# Altium schematic sheet TMS320F28379D_PWM.SchDoc
size A4
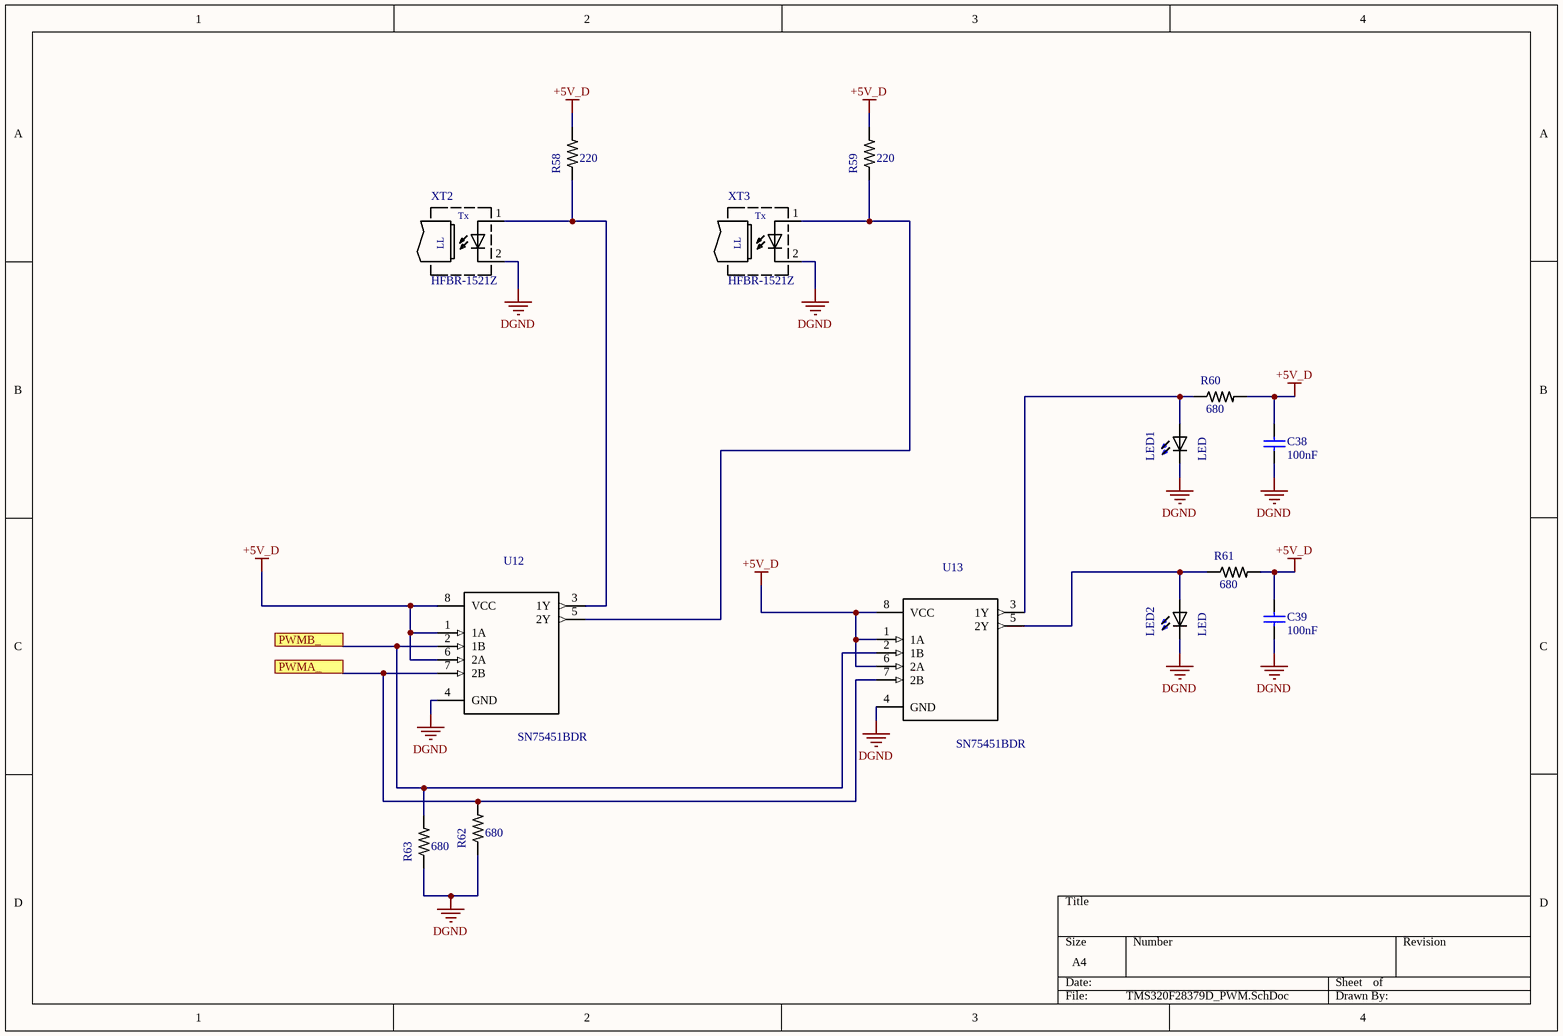
[diagram p0: TMS320F28379D_PWM.SchDoc]

## Parts
C38  value 100nF  [CAP 0805]  (hidden comment: Cap cerámico)
C39  value 100nF  [CAP 0805]  (hidden comment: Cap cerámico)
LED1  LED  [LED_0805]
LED2  LED  [LED_0805]
R58  value 220  [Resistor 0805]  (hidden comment: Resistor 0805)
R59  value 220  [Resistor 0805]  (hidden comment: Resistor 0805)
R60  value 680  [Resistor 0805]  (hidden comment: Resistor 0805)
R61  value 680  [Resistor 0805]  (hidden comment: Resistor 0805)
R62  value 680  [Resistor 0805]  (hidden comment: Resistor 0805)
R63  value 680  [Resistor 0805]  (hidden comment: Resistor 0805)
U12  SN75451BDR  [8-SOIC]
U13  SN75451BDR  [8-SOIC]
XT2  HFBR-1521Z  [HFBR-15X1Z]
XT3  HFBR-1521Z  [HFBR-15X1Z]

## Ports
PWMA_, PWMB_

## Nets
+5V_D: C38.1 C39.1 R58.2 R59.2 R60.2 R61.2 U12.1(1A) U12.6(2A) U12.8(VCC) U13.1(1A) U13.6(2A) U13.8(VCC)
DGND: C38.2 C39.2 LED1.1(NEG) LED2.1(NEG) R62.1 R63.1 U12.4(GND) U13.4(GND) XT2.2(C) XT3.2(C)
PWMA_: R62.2 U12.7(2B) U13.7(2B) ; port PWMA_
PWMB_: R63.2 U12.2(1B) U13.2(1B) ; port PWMB_
NetLED1_2: LED1.2(POS) R60.1 U13.3(1Y)
NetLED2_2: LED2.2(POS) R61.1 U13.5(2Y)
NetR58_1: R58.1 U12.3(1Y) XT2.1(A)
NetR59_1: R59.1 U12.5(2Y) XT3.1(A)

## Notes on the sheet
- (in symbol HFBR-1521Z) Tx; LL

## Library data of the parts
LED1 LED2 = LED: Manufacturer Part Number: 150080RS75000; Digi-Key Part Number: 732-4984-1-ND
R58 R59 = Resistor: Código de producto RS: 713-6875; Digi-Key Part Number: *; Manufacturer Part Number: *
R60-R63 = Resistor: Digi-Key Part Number: *; Manufacturer Part Number: *
U12 U13 = SN75451BDR: Dual Very-High Speed, High-Current Peripheral Drivers 8-SOIC 0 to 70; Código de producto RS: 662-4015; Manufacturer Part Number: SN75451BDR; Digi-Key Part Number: 296-14960-6-ND
XT2 XT3 = HFBR-1521Z: Código de producto RS: 171-1600; Digi-Key Part Number: 516-2043-ND; Manufacturer Part Number: HFBR-1521Z
C38 C39 = Cap cerámico: Digi-Key Part Number: *; Manufacturer Part Number: *